# Altium schematic sheet LED.SchDoc
size A3; SheetNumber: 1; SheetTotal: 1
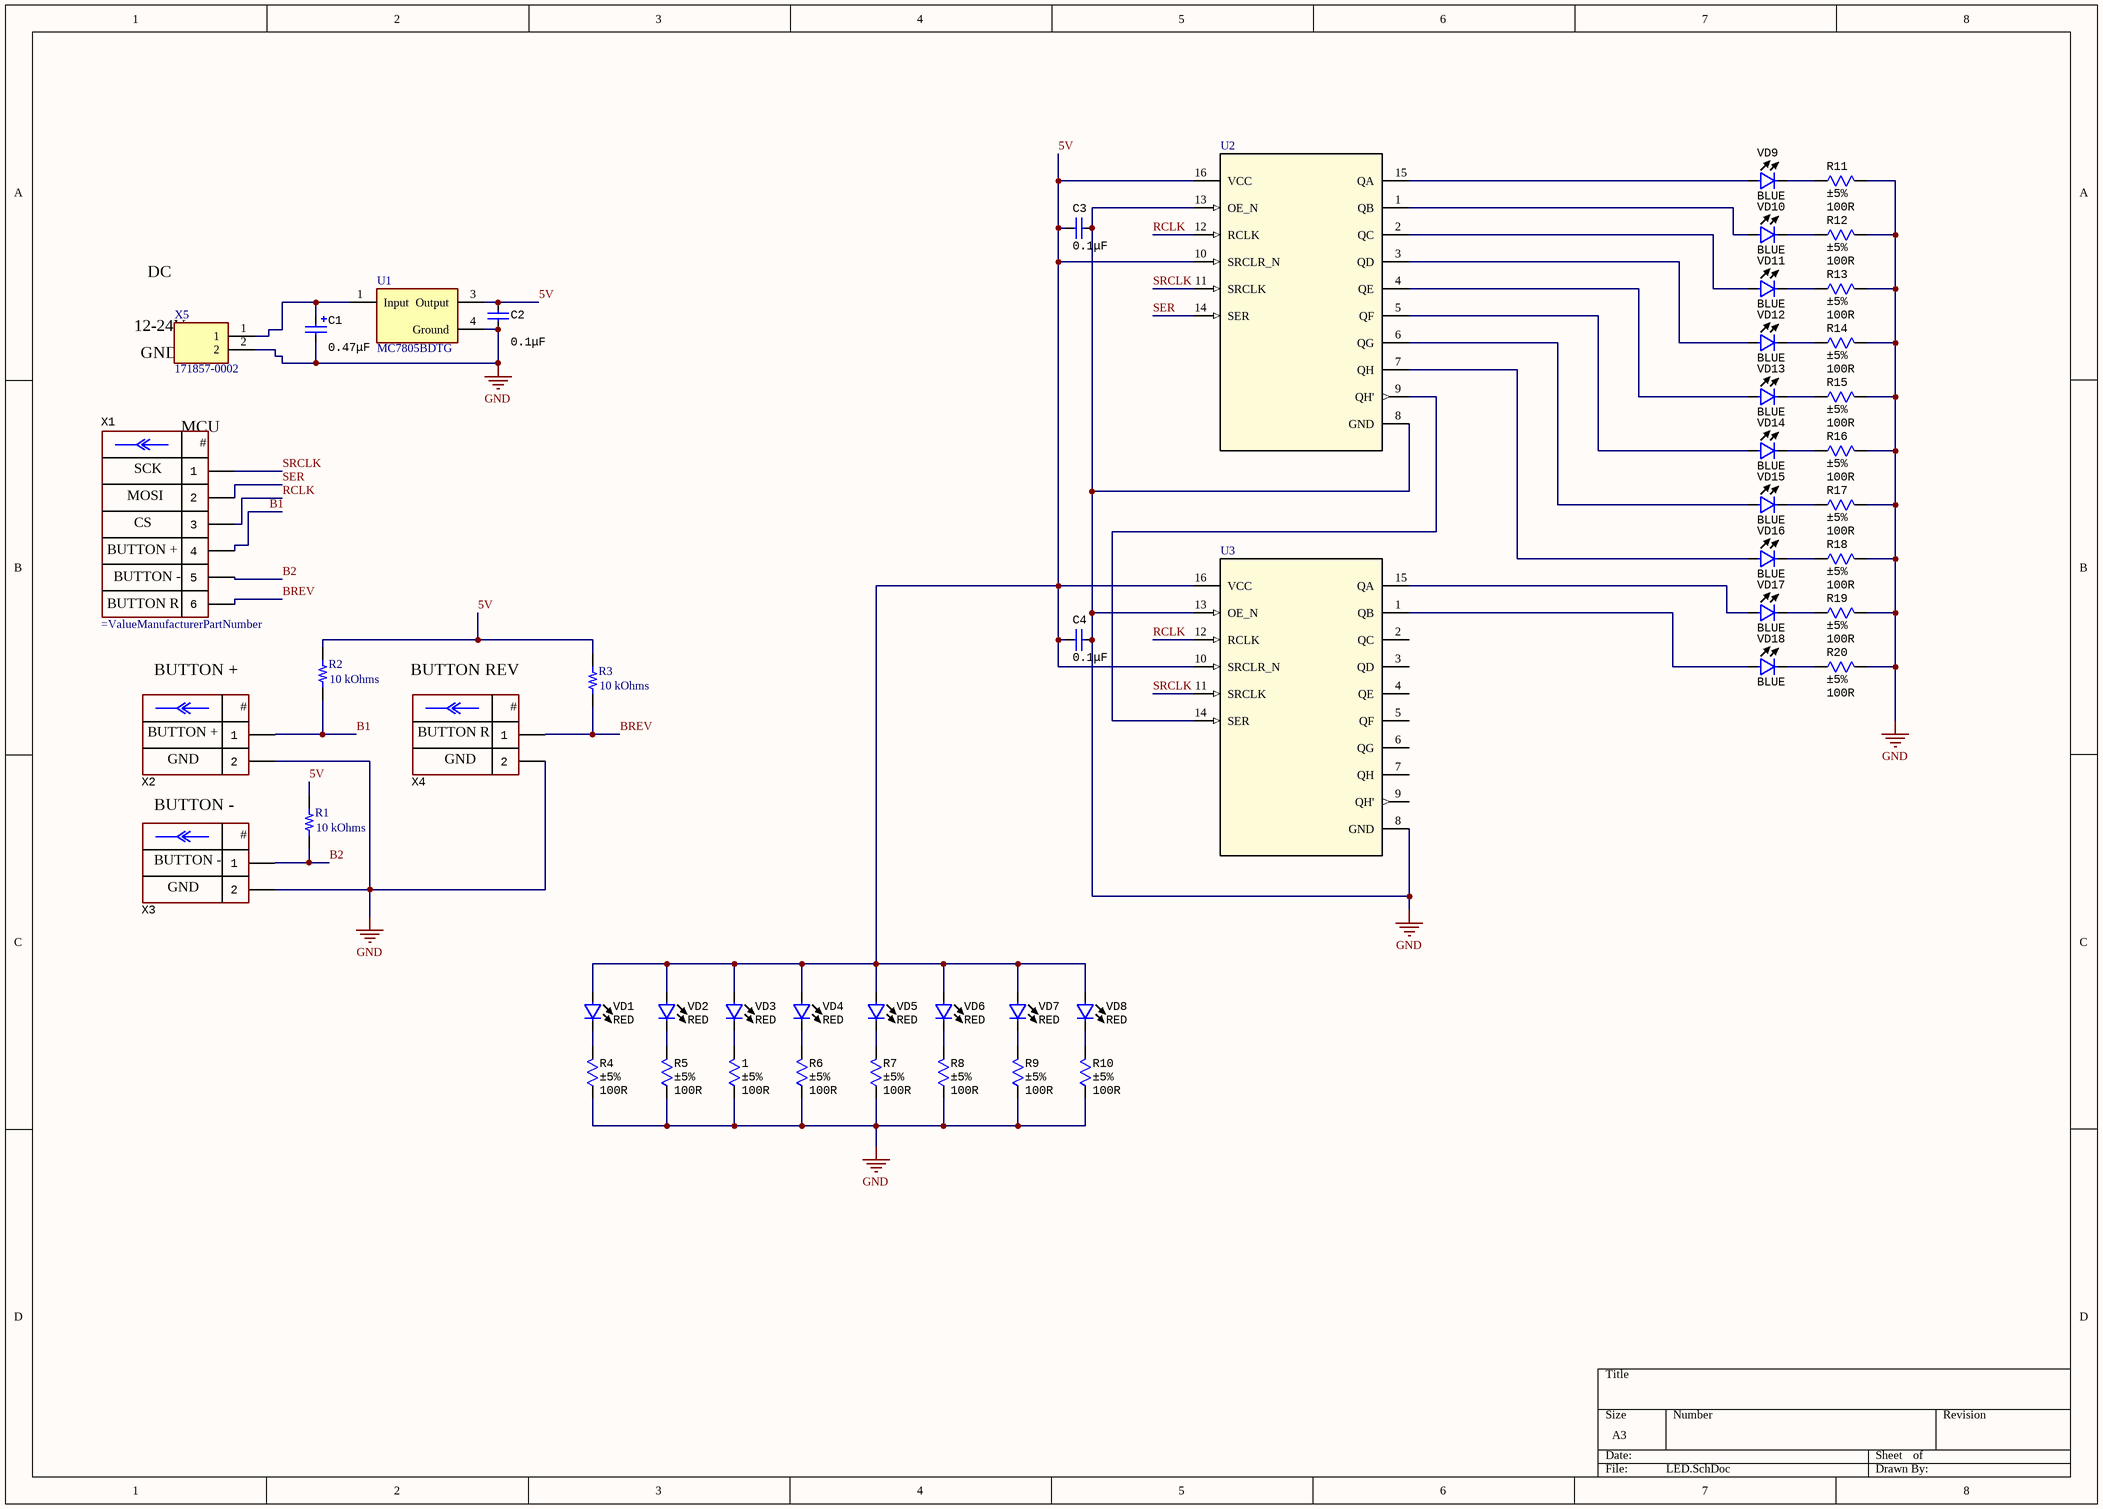
[diagram p0: LED.SchDoc]

## Parts
1  value 100R  Tolerance: ±5%  [RES: 0805]
C1  value 0.47μF  [CAP: TANTAL-A]
C2  value 0.1μF  [CAP: 0805]
C3  value 0.1μF  [CAP: 0805]
C4  value 0.1μF  [CAP: 0805]
R1  10 kOhms  [RES 0805_2012]
R2  10 kOhms  [RES 0805_2012]
R3  10 kOhms  [RES 0805_2012]
R4  value 100R  Tolerance: ±5%  [RES: 0805]
R5  value 100R  Tolerance: ±5%  [RES: 0805]
R6  value 100R  Tolerance: ±5%  [RES: 0805]
R7  value 100R  Tolerance: ±5%  [RES: 0805]
R8  value 100R  Tolerance: ±5%  [RES: 0805]
R9  value 100R  Tolerance: ±5%  [RES: 0805]
R10  value 100R  Tolerance: ±5%  [RES: 0805]
R11  value 100R  Tolerance: ±5%  [RES: 0805]
R12  value 100R  Tolerance: ±5%  [RES: 0805]
R13  value 100R  Tolerance: ±5%  [RES: 0805]
R14  value 100R  Tolerance: ±5%  [RES: 0805]
R15  value 100R  Tolerance: ±5%  [RES: 0805]
R16  value 100R  Tolerance: ±5%  [RES: 0805]
R17  value 100R  Tolerance: ±5%  [RES: 0805]
R18  value 100R  Tolerance: ±5%  [RES: 0805]
R19  value 100R  Tolerance: ±5%  [RES: 0805]
R20  value 100R  Tolerance: ±5%  [RES: 0805]
U1  Part Number: MC7805BDTG  [ON_Semi_CASE_369C_0]  (hidden comment: IC_ON_Semi_MC7805BDTG_eec)
U2  (no value)  [D0016A_N]
U3  (no value)  [D0016A_N]
VD1  Color: RED  [LED: 1206R]
VD2  Color: RED  [LED: 1206R]
VD3  Color: RED  [LED: 1206R]
VD4  Color: RED  [LED: 1206R]
VD5  Color: RED  [LED: 1206R]
VD6  Color: RED  [LED: 1206R]
VD7  Color: RED  [LED: 1206R]
VD8  Color: RED  [LED: 1206R]
VD9  Color: BLUE  [LED: 1206B]
VD10  Color: BLUE  [LED: 1206B]
VD11  Color: BLUE  [LED: 1206B]
VD12  Color: BLUE  [LED: 1206B]
VD13  Color: BLUE  [LED: 1206B]
VD14  Color: BLUE  [LED: 1206B]
VD15  Color: BLUE  [LED: 1206B]
VD16  Color: BLUE  [LED: 1206B]
VD17  Color: BLUE  [LED: 1206B]
VD18  Color: BLUE  [LED: 1206B]
X1  (no value)  [CON: CWF-6R]
X2  (no value)  [MW-2MR]
X3  (no value)  [MW-2MR]
X4  (no value)  [MW-2MR]
X5  171857-0002  [171857-0002]

## Nets
GND: 1.1 C1.2 C2.2 C3.2 C4.2 R4.1 R5.1 R6.1 R7.1 R8.1 R9.1 R10.1 R11.2 R12.2 R13.2 R14.2 R15.2 R16.2 R17.2 R18.2 R19.2 R20.2 U1.4(Ground) U2.8(GND) U2.13(OE_N) U3.8(GND) U3.13(OE_N) X2.2 X3.2 X4.2 X5.2
5V: C2.1 C3.1 C4.1 R1.2 R2.2 R3.2 U1.3(Output) U2.10(SRCLR_N) U2.16(VCC) U3.10(SRCLR_N) U3.16(VCC) VD1.1 VD2.1 VD3.1 VD4.1 VD5.1 VD6.1 VD7.1 VD8.1
B1: R2.1 X1.4 X2.1
B2: R1.1 X1.5 X3.1
BREV: R3.1 X1.6 X4.1
RCLK: U2.12(RCLK) U3.12(RCLK) X1.3
SER: U2.14(SER) X1.2
SRCLK: U2.11(SRCLK) U3.11(SRCLK) X1.1
Net1_2: 1.2 VD3.2
NetC1_1: C1.1 U1.1(Input) X5.1
NetR4_2: R4.2 VD1.2
NetR5_2: R5.2 VD2.2
NetR6_2: R6.2 VD4.2
NetR7_2: R7.2 VD5.2
NetR8_2: R8.2 VD6.2
NetR9_2: R9.2 VD7.2
NetR10_2: R10.2 VD8.2
NetR11_1: R11.1 VD9.2
NetR12_1: R12.1 VD10.2
NetR13_1: R13.1 VD11.2
NetR14_1: R14.1 VD12.2
NetR15_1: R15.1 VD13.2
NetR16_1: R16.1 VD14.2
NetR17_1: R17.1 VD15.2
NetR18_1: R18.1 VD16.2
NetR19_1: R19.1 VD17.2
NetR20_1: R20.1 VD18.2
NetU2_1: U2.1(QB) VD10.1
NetU2_2: U2.2(QC) VD11.1
NetU2_3: U2.3(QD) VD12.1
NetU2_4: U2.4(QE) VD13.1
NetU2_5: U2.5(QF) VD14.1
NetU2_6: U2.6(QG) VD15.1
NetU2_7: U2.7(QH) VD16.1
NetU2_9: U2.9(QH') U3.14(SER)
NetU2_15: U2.15(QA) VD9.1
NetU3_1: U3.1(QB) VD18.1
NetU3_15: U3.15(QA) VD17.1

Not connected (* = marked no-connect by the designer): U3 2(QC) 3(QD) 4(QE) 5(QF) 6(QG) 7(QH) 9(QH')

## Notes on the sheet
- DC
- (near X5) 12-24V
- GND
- (near X1) MCU
- (near X1) MOSI
- (near X1) SCK
- (near X1) BUTTON +
- (near X1) BUTTON -
- CS
- (near X1) BUTTON R
- BUTTON +
- BUTTON REV
- (near X2) BUTTON +
- (near X4) BUTTON R
- (near X4) GND
- BUTTON -
- (near X3) BUTTON -
- (in symbol CWF-2) #
- (in symbol CWF-6) #

## Library data of the parts
1 R4-R20 = Resistor: Manufacturer: Yageo; PartNumber: RC0201JR-07100RL; ValueManufacturerPartNumber: Resistor film, 100R, ±5%, 0201, 0.05W, -55...+125°C; TypeResistor: Resistor film; Power: 0.05W; Package: 0201; HelpURL: https://www.digikey.com/product-detail/en/yageo/RC0201JR-07100RL/311-100NCT-ND/1949006; Temperature: -55...+125°C
C1 = Tantal: Manufacturer: AVX; PartNumber: F930J107KAAAJ6; ValueManufacturerPartNumber: Tantalum capacitor, 0.47μF, 6.3V, ±10%, 2Ohm, case A (3216), -55...+125°C; Impedance: 2Ohm; Tolerance: ±10%; TypeDielectric: X7R; TypeCapacitor: Tantalum capacitor; Voltage: 6.3V; Package: case A (3216); HelpURL: https://www.digikey.com/product-detail/en/avx-corporation/F930J107KAAAJ6/478-12404-1-ND/9645231; Temperature: -55...+125°C
C2-C4 = Ceramic: Manufacturer: Yageo; PartNumber: CC0201KRX7R7BB103; ValueManufacturerPartNumber: Ceramic capacitor, 0.1μF, X7R, ±10%, 16V, 0201, -55...+125°C; TypeCapacitor: Ceramic capacitor; Tolerance: ±10%; TypeDielectric: X7R; Voltage: 16V; Package: 0201; HelpURL: https://www.digikey.com/product-detail/en/yageo/CC0201KRX7R7BB103/311-1404-1-ND/2833710; Temperature: -55...+125°C
R1-R3 = RT0805DRD0710KL: RES SMD 10K OHM 0.5% 1/8W 0805; Manufacturer: Yageo; Power (Watts): 0.125W, 1/8W; Temperature Coefficient: ±25ppm/°C; Part Number: RT0805DRD0710KL; Value: 10 kOhms; ComponentLink1Description: Datasheet; ComponentLink1URL: https://www.yageo.com/upload/media/product/productsearch/datasheet/rchip/PYu-RT_1-to-0.01_RoHS_L_11.pdf; ComponentLink2Description: DigiKey Link; ComponentLink2URL: http://digikey.com/product-detail/en/yageo/RT0805DRD0710KL/311-2699-1-ND/6129118; Composition: Thin Film; Device Package: 0805 (2012 Metric); Height - Seated (Max): 0.024" (0.60mm); LastUpdated: 02.09.2020 01:15:24; Lifecycle Status: Active; Minimum Order: 1; Number of Terminations: 2; Operating Temperature: -55°C ~ 155°C; Package / Case: 0805 (2012 Metric); Packaging: TapeAndReel; PartId: 27797; Part Status: Active; Price: 0.03; Resistance: 10 kOhms; Series: RT; Size / Dimension: 0.079" L x 0.049" W (2.00mm x 1.25mm); Supplier 1: DigiKey; Supplier Part Number 1: 311-2699-1-ND; Supplier Device Package: 0805; Tolerance: ±0.5%
U1 = IC_ON_Semi_MC7805BDTG_eec: IC REG LINEAR 5V 1A DPAK-3; Manufacturer: ON Semi; Mfg Package Ident: CASE 369C; helpURL: https://upverter.com/upn/revision/fe0024d15b1aad39/; ComponentLink2Description: Datasheet; Temperature: -40°C to +125°C; Package: CASE 369C; Supplier 2: Mouser; Supplier 1: Digi-Key; ComponentLink1URL: https://upverter.com/upn/revision/fe0024d15b1aad39/; Supplier Part Number 2: 863-MC7805BDTG; Supplier Part Number 1: MC7805BDTGOS-ND; ComponentLink1Description: Upverter; ComponentLink2URL: https://www.onsemi.com/pub/Collateral/MC7800-D.PDF; RoHS: TRUE; Mouser Part Number: 863-MC7805BDTG; Temperature Range High: +125°C; Digikey Description: IC REG LINEAR 5V 1A DPAK-3; Digikey Part Number: MC7805BDTGOS-ND; Lead Free: yes; Temperature Range Low: -40°C
U2 U3 = SN74HC595D: No Description Available; PartNumber: SN74HC595DR; Manufacturer: Texas Instruments; RefDes: RefDes; Type: DEV; Value: Value; Copyright: Copyright (C) 2021 Accelerated Designs. All rights reserved
VD1-VD8 = LED_single: ValueManufacturerPartNumber: LED, RED, *, *, *, -55...+150°C; TypeDiode: LED; Manufacturer: *; Package: *; HelpURL: *; Temperature: -55...+150°C; Current: *; VoltageDrop: *; PartNumber: *; ColorParameter: RED
VD9-VD18 = LED_single: ValueManufacturerPartNumber: LED, BLUE, *, *, *, -55...+150°C; TypeDiode: LED; Manufacturer: *; Package: *; HelpURL: *; Temperature: -55...+150°C; Current: *; VoltageDrop: *; PartNumber: *; ColorParameter: BLUE
X1 = CWF-6: Manufacturer: Connfly; ValueManufacturerPartNumber: Connector, 6pin, 2.54mm, 250VAC, 3A; PartNumber: CWF-6R; TypeConnector: Connector; VoltageMax: 250VAC; Pitch: 2.54mm; CurrentMax: 3A; Multichannel: 6pin; CommentText: "Разъем"; HelpURL: https://www.chipdip.ru/product/cwf-6r-ds1069-6-mr
X2-X4 = CWF-2: Manufacturer: Connfly; ValueManufacturerPartNumber: Connector, 2pin, 2.54mm, 250VAC, 3A; PartNumber: CWF-2R; TypeConnector: Connector; VoltageMax: 250VAC; Pitch: 2.54mm; CurrentMax: 3A; Multichannel: 2pin; CommentText: "Разъем"; HelpURL: https://www.chipdip.ru/product/cwf-2r-ds1069-2-mr
X5 = 171857-0002: Connector; Manufacturer_Name: Molex; Datasheet Link: http://www.molex.com/webdocs/datasheets/pdf/en-us//1718570002_PCB_HEADERS.pdf; Manufacturer_Part_Number: 171857-0002; Mouser Part Number: 538-171857-0002; Mouser Price/Stock: https://www.mouser.co.uk/ProductDetail/Molex/171857-0002?qs=vOeJqewp7jDZ%2FeRg0MxvZQ%3D%3D